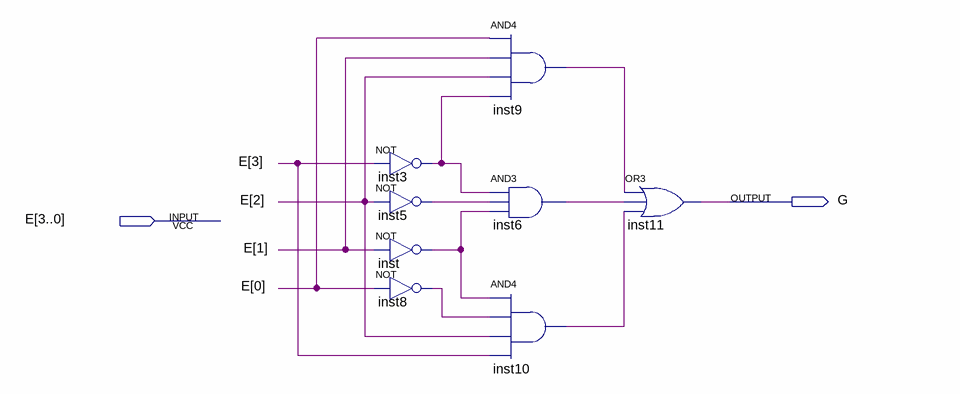
[diagram p0: schematic sheet]
// Quartus schematic seg_G.bdf as structural Verilog: 8 symbols, 2 pins
module seg_G (
  input  [3:0] E,
  output G
);

  wire inst3_out, inst5_out, inst6_out, inst8_out, inst9_out, inst10_out, inst_out;

  not inst3 (inst3_out, E[3]);
  not inst5 (inst5_out, E[2]);
  not inst (inst_out, E[1]);
  not inst8 (inst8_out, E[0]);
  and inst9 (inst9_out, E[0], E[1], E[2], inst3_out);
  and inst6 (inst6_out, inst3_out, inst5_out, inst_out);
  and inst10 (inst10_out, inst_out, inst8_out, E[2], E[3]);
  or inst11 (G, inst9_out, inst6_out, inst10_out);
endmodule
